# Altium schematic sheet [1]-POWER.SchDoc
size A3; CompanyName: Lumi.,JSC; Organization: Lumi Viet Nam ., JSC; Address1: 4th Floor, LUMI Building; Address2: 38th Do Duc Duc Street; Address3: Nam Tu Liem District; Address4: Ha Noi; DocumentNumber: 1; SheetNumber: 1; SheetTotal: 12
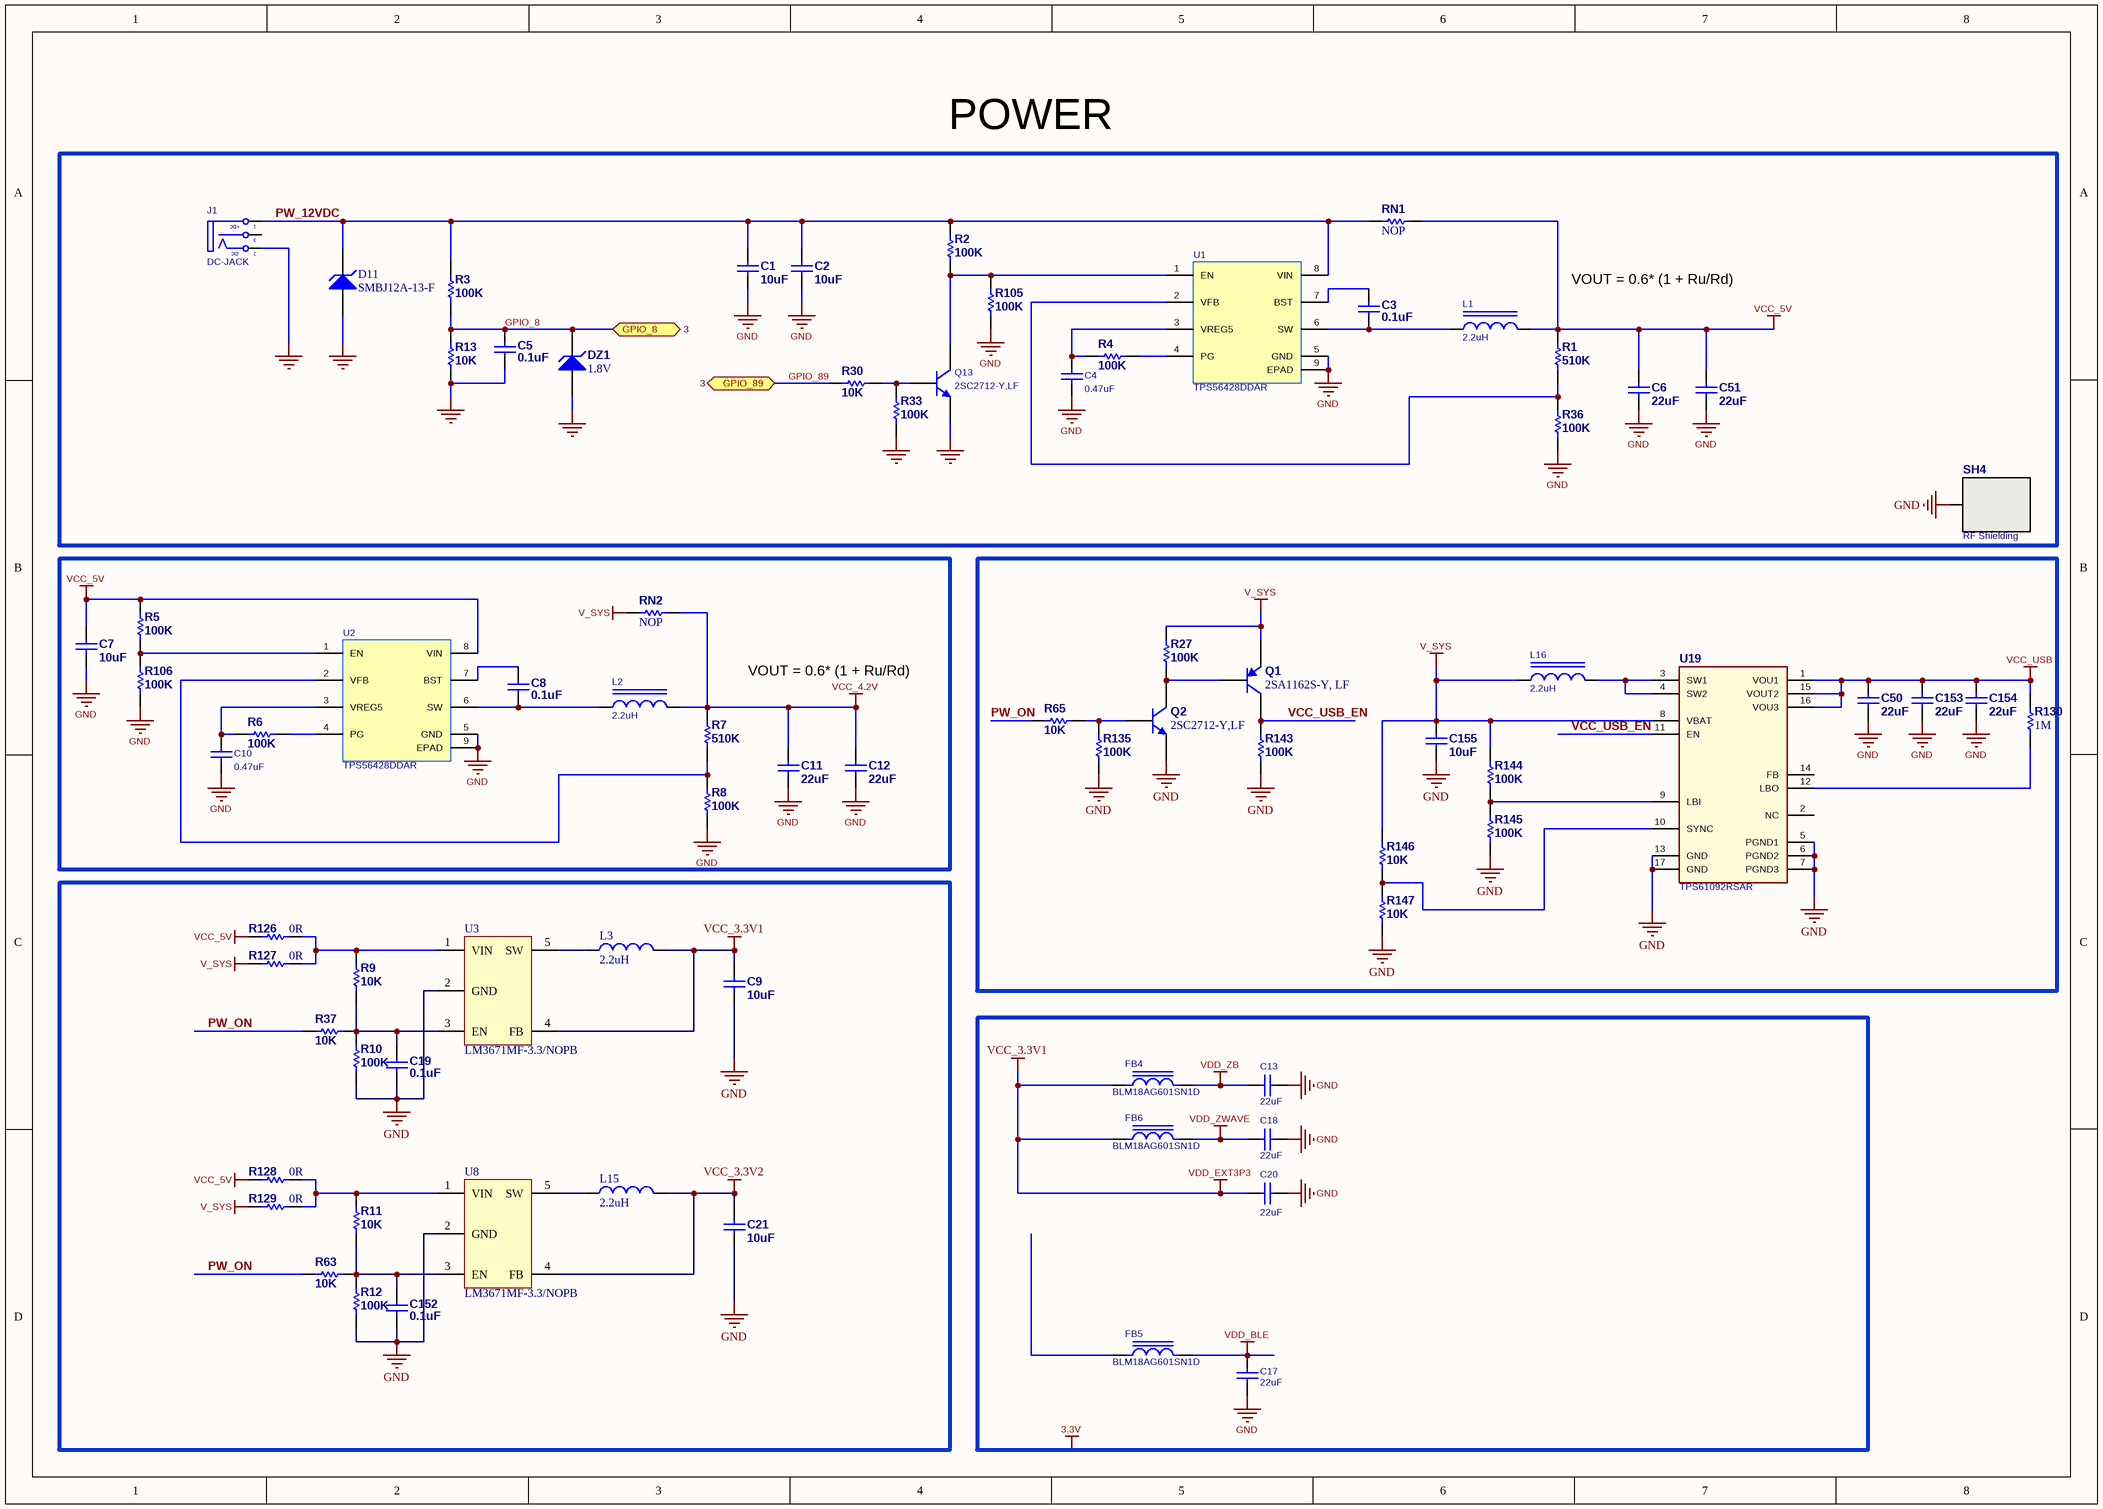
[diagram p0: [1]-POWER.SchDoc]

## Parts
C1  Capacitance: 10uF  [C0805]  (hidden comment: TMK212BBJ106KG-T)
C2  Capacitance: 10uF  [C0805]  (hidden comment: TMK212BBJ106KG-T)
C3  Capacitance: 0.1uF  [C0603]  (hidden comment: 0603B104K500CT)
C4  Capacitance: 0.47uF  [C0603]  (hidden comment: 0603B474K500CT)
C5  Capacitance: 0.1uF  [C0603]  (hidden comment: 0603B104K500CT)
C6  Capacitance: 22uF  [C0805]  (hidden comment: 0805X226M100CT)
C7  Capacitance: 10uF  [C0805]  (hidden comment: TMK212BBJ106KG-T)
C8  Capacitance: 0.1uF  [C0603]  (hidden comment: 0603B104K500CT)
C9  Capacitance: 10uF  [C0805]  (hidden comment: TMK212BBJ106KG-T)
C10  Capacitance: 0.47uF  [C0603]  (hidden comment: 0603B474K500CT)
C11  Capacitance: 22uF  [C0805]  (hidden comment: 0805X226M100CT)
C12  Capacitance: 22uF  [C0805]  (hidden comment: 0805X226M100CT)
C13  Capacitance: 22uF  [C0805]  (hidden comment: 0805X226M100CT)
C17  Capacitance: 22uF  [C0805]  (hidden comment: 0805X226M100CT)
C18  Capacitance: 22uF  [C0805]  (hidden comment: 0805X226M100CT)
C19  Capacitance: 0.1uF  [C0603]  (hidden comment: 0603B104K500CT)
C20  Capacitance: 22uF  [C0805]  (hidden comment: 0805X226M100CT)
C21  Capacitance: 10uF  [C0805]  (hidden comment: TMK212BBJ106KG-T)
C50  Capacitance: 22uF  [C0805]  (hidden comment: 0805X226M100CT)  (no BOM)
C51  Capacitance: 22uF  [C0805]  (hidden comment: 0805X226M100CT)
C152  Capacitance: 0.1uF  [C0603]  (hidden comment: 0603B104K500CT)
C153  Capacitance: 22uF  [C0805]  (hidden comment: 0805X226M100CT)  (no BOM)
C154  Capacitance: 22uF  [C0805]  (hidden comment: 0805X226M100CT)  (no BOM)
C155  Capacitance: 10uF  [C0805]  (hidden comment: TMK212BBJ106KG-T)  (no BOM)
D11  SMBJ12A-13-F  [DO214AC]
DZ1  Max. operating voltage: 1.8V  [SOD323]  (hidden comment: MMSZ5242BT1G)  (no BOM)
FB4  BLM18AG601SN1D  [L0603]
FB5  BLM18AG601SN1D  [L0603]
FB6  BLM18AG601SN1D  [L0603]
J1  DC-JACK  [DC-IN]
L1  Inductance: 2.2uH  [SRP5020TA]  (hidden comment: SRP5020TA-2R2M)
L2  Inductance: 2.2uH  [SRP5020TA]  (hidden comment: SRP5020TA-2R2M)
L3  Inductance: 2.2uH  [L1210]  (hidden comment: BRL3225T2R2M)
L15  Inductance: 2.2uH  [L1210]  (hidden comment: BRL3225T2R2M)
L16  Inductance: 2.2uH  [SRP5020TA]  (hidden comment: SRP5020TA-2R2M)  (no BOM)
Q1  2SA1162S-Y, LF  [SOT23-3]  (no BOM)
Q2  2SC2712-Y,LF  [SOT23-3]  (no BOM)
Q13  2SC2712-Y,LF  [SOT_23_TO_236AB_REFLOW]
R1  Resistance (Ohms): 510K  [R0603]  (hidden comment: RC0603FR-07510KL)
R2  Resistance (Ohms): 100K  [R0603]  (hidden comment: WR06X1003 FTL)
R3  Resistance (Ohms): 100K  [R0603]  (hidden comment: WR06X1003 FTL)
R4  Resistance (Ohms): 100K  [R0603]  (hidden comment: WR06X1003 FTL)
R5  Resistance (Ohms): 100K  [R0603]  (hidden comment: WR06X1003 FTL)
R6  Resistance (Ohms): 100K  [R0603]  (hidden comment: WR06X1003 FTL)
R7  Resistance (Ohms): 510K  [R0603]  (hidden comment: RC0603FR-07510KL)
R8  Resistance (Ohms): 100K  [R0603]  (hidden comment: WR06X1003 FTL)
R9  Resistance (Ohms): 10K  [R0603]  (hidden comment: WR06X103 JTL)
R10  Resistance (Ohms): 100K  [R0603]  (hidden comment: WR06X1003 FTL)
R11  Resistance (Ohms): 10K  [R0603]  (hidden comment: WR06X103 JTL)
R12  Resistance (Ohms): 100K  [R0603]  (hidden comment: WR06X1003 FTL)
R13  Resistance (Ohms): 10K  [R0603]  (hidden comment: WR06X103 JTL)
R27  Resistance (Ohms): 100K  [R0603]  (hidden comment: WR06X1003 FTL)  (no BOM)
R30  Resistance (Ohms): 10K  [R0603]  (hidden comment: WR06X103 JTL)
R33  Resistance (Ohms): 100K  [R0603]  (hidden comment: WR06X1003 FTL)
R36  Resistance (Ohms): 100K  [R0603]  (hidden comment: WR06X1003 FTL)
R37  Resistance (Ohms): 10K  [R0603]  (hidden comment: WR06X103 JTL)  (no BOM)
R63  Resistance (Ohms): 10K  [R0603]  (hidden comment: WR06X103 JTL)  (no BOM)
R65  Resistance (Ohms): 10K  [R0603]  (hidden comment: WR06X103 JTL)  (no BOM)
R105  Resistance (Ohms): 100K  [R0603]  (hidden comment: WR06X1003 FTL)
R106  Resistance (Ohms): 100K  [R0603]  (hidden comment: WR06X1003 FTL)
R126  Resistance (Ohms): 0R  [R0603]  (hidden comment: WR06X000 PTL)
R127  Resistance (Ohms): 0R  [R0603]  (hidden comment: WR06X000 PTL)  (no BOM)
R128  Resistance (Ohms): 0R  [R0603]  (hidden comment: WR06X000 PTL)
R129  Resistance (Ohms): 0R  [R0603]  (hidden comment: WR06X000 PTL)  (no BOM)
R130  Resistance (Ohms): 1M  [R0603]  (hidden comment: WR06X105 FTL)  (no BOM)
R135  Resistance (Ohms): 100K  [R0603]  (hidden comment: WR06X1003 FTL)  (no BOM)
R143  Resistance (Ohms): 100K  [R0603]  (hidden comment: WR06X1003 FTL)  (no BOM)
R144  Resistance (Ohms): 100K  [R0603]  (hidden comment: WR06X1003 FTL)  (no BOM)
R145  Resistance (Ohms): 100K  [R0603]  (hidden comment: WR06X1003 FTL)  (no BOM)
R146  Resistance (Ohms): 10K  [R0603]  (hidden comment: WR06X103 JTL)  (no BOM)
R147  Resistance (Ohms): 10K  [R0603]  (hidden comment: WR06X103 JTL)  (no BOM)
RN1  Resistance (Ohms): NOP  [R1206]  (hidden comment: WR12X000 PTL)  (no BOM)
RN2  Resistance (Ohms): NOP  [R1206]  (hidden comment: WR12X000 PTL)  (no BOM)
SH4  RF Shielding  [RFSHIELD_34x37]  (no BOM)
U1  TPS56428DDAR  [SOP8-PAD]
U2  TPS56428DDAR  [SOP8-PAD]
U3  LM3671MF-3.3/NOPB  [SOT23-5]
U8  LM3671MF-3.3/NOPB  [SOT23-5]
U19  TPS61092RSAR  [QFN16-4x4x0.7-0.65]  (no BOM)

## Blocks framed on the sheet
POWER: C1-C6 C51 D11 DZ1 J1 L1 Q13 R1-R4 R13 R30 R33 R36 R105 RN1 SH4 U1
VOUT = 0.6* (1 + Ru/Rd): C7 C8 C10-C12 L2 R5-R8 R106 RN2 U2

## Ports
GPIO_8 (bidir, see 3), GPIO_89 (bidir, see 3)

## Nets
GND: C1.1 C2.1 C4.1 C5.1 C6.1 C7.1 C9.1 C10.1 C11.1 C12.1 C13.1 C17.2 C18.2 C19.1 C20.1 C21.1 C50.1 C51.1 C152.1 C153.1 C154.1 C155.1 D11.1(A) DZ1.1(A) J1.2(TN) Q2.2(E) Q13.2(E) R8.2 R10.2 R12.2 R13.1 R33.1 R36.2 R105.1 R106.1 R135.2 R143.2 R145.2 R147.2 SH4.1 U1.5(GND) U1.9(EPAD) U2.5(GND) U2.9(EPAD) U3.2(GND) U8.2(GND) U19.5(PGND1) U19.6(PGND2) U19.7(PGND3) U19.13(GND) U19.17(GND)
V_SYS: C155.2 L16.1 Q1.2(E) R27.1 R127.1 R129.1 R144.1 R146.1 RN2.1 U19.8(VBAT)
VCC_3.3V1: C9.2 C20.2 FB4.1 FB6.1 L3.2 U3.4(FB)  [also labelled VDD_EXT3P3]
VCC_3.3V2: C21.2 L15.2 U8.4(FB)
VCC_4.2V: C11.2 C12.2 L2.2 R7.1 RN2.2
VCC_5V: C6.2 C7.2 C51.2 L1.2 R1.1 R5.2 R126.1 R128.1 RN1.2 U2.8(VIN)
VCC_USB: C50.2 C153.2 C154.2 R130.2 U19.1(VOU1) U19.15(VOUT2) U19.16(VOU3)
VDD_BLE: C17.1 FB5.2
VDD_ZB: C13.2 FB4.2
VDD_ZWAVE: C18.1 FB6.2
GPIO_8: C5.2 DZ1.2(K) R3.1 R13.2 ; port GPIO_8
GPIO_89: R30.2 ; port GPIO_89
PW_12VDC: C1.2 C2.2 D11.2(K) J1.1(T) R2.2 R3.2 RN1.1 U1.8(VIN)
PW_ON: R37.2 R63.2 R65.1
VCC_USB_EN: Q1.3(C) R143.1 U19.11(EN)
NetC3_1: C3.1 L1.1 U1.6(SW)
NetC3_2: C3.2 U1.7(BST)
NetC4_2: C4.2 R4.2 U1.3(VREG5)
NetC8_1: C8.1 L2.1 U2.6(SW)
NetC8_2: C8.2 U2.7(BST)
NetC10_2: C10.2 R6.2 U2.3(VREG5)
NetC19_2: C19.2 R9.2 R10.1 R37.1 U3.3(EN)
NetC152_2: C152.2 R11.2 R12.1 R63.1 U8.3(EN)
NetL3_1: L3.1 U3.5(SW)
NetL15_1: L15.1 U8.5(SW)
NetL16_2: L16.2 U19.3(SW1) U19.4(SW2)
NetQ1_1: Q1.1(B) Q2.3(C) R27.2
NetQ2_1: Q2.1(B) R65.2 R135.1
NetQ13_1: Q13.1(B) R30.1 R33.2
NetQ13_3: Q13.3(C) R2.1 R105.2 U1.1(EN)
NetR1_2: R1.2 R36.1 U1.2(VFB)
NetR4_1: R4.1 U1.4(PG)
NetR5_1: R5.1 R106.2 U2.1(EN)
NetR6_1: R6.1 U2.4(PG)
NetR7_2: R7.2 R8.1 U2.2(VFB)
NetR9_1: R9.1 R126.2 R127.2 U3.1(VIN)
NetR11_1: R11.1 R128.2 R129.2 U8.1(VIN)
NetR130_1: R130.1 U19.12(LBO)
NetR144_2: R144.2 R145.1 U19.9(LBI)
NetR146_2: R146.2 R147.1 U19.10(SYNC)

Not connected (* = marked no-connect by the designer): FB5 1; J1 3(S); SH4 2; U19 2(NC) 14(FB)

## Notes on the sheet
- VOUT = 0.6* (1 + Ru/Rd)
- Labels drawn without touching a wire or pin: 3.3V
- (in symbol DCIN) +DC; -DC

## Library data of the parts
C1 C2 C7 C9 C21 C155 = CAP_10uF_0805: CAP, CERM, 10uF, 25V, +/-10%, X5R, 0402; Manufacturer Device Package: 0805; Manufacturer: Taiyo Yuden; Lumi PART: CAP_10uF_0805; Manufacturer Part Number: TMK212BBJ106KG-T; Size / Dimension: 2.0mm x 1.25mm x 1.25mm; Alias: CAP_10uF_0805; Operating voltage: 25V; Price: 0.035
C3 C5 C8 C19 C152 = CERM_0.1uF_0603: CAP, CERM, 0.1uF, 50V, +/-10%, X7R, 0603; Manufacturer Device Package: 0603 (1608 Metric); Lumi PART: CAP_104_0603; Manufacturer: Walsin; Alias: CAP_0.1uF_0603; Manufacturer Part Number: 0603B104K500CT; Size / Dimension: 1.60mm x 0.80mm x 0.8mm; Operating voltage: 50V
C4 C10 = CERM_0.47uF_0603: CAP, CERM, 0.47uF, 50V, +/-10%, X7R, 0603; Manufacturer Device Package: 0603 (1608 Metric); Lumi PART: CAP_0.47uF_0603; Manufacturer: Walsin; Manufacturer Part Number: 0603B474K500CT; Size / Dimension: 1.60mm x 0.80mm x 0.8mm; Alias: CAP_0.47uF_0603; Operating voltage: 50V
C6 C11 C12 C50 C51 C153 C154 = CERM_22uF_0805: CAP, CERM, 22uF, 10V, +/-20%, X5R, 0805; Manufacturer Device Package: 0805 (2012 Metric); Lumi PART: CAP_22uF_0805; Manufacturer: Walsin; Manufacturer Part Number: 0805X226M100CT; Size / Dimension: 2.0mm x 1.25mm x 1.25mm; Alias: CAP_22uF_0805; Operating voltage: 10V
C13 C17 C18 C20 = CERM_22uF_0805: CAP, CERM, 22uF, 10V, +/-20%, X5R, 0805; Manufacturer Device Package: 0805 (2012 Metric); Lumi PART: CAP_22uF_0805; Manufacturer: Walsin; Tolerance: ±20%; Component Type: Ceramic X5R; Mounting: SMD; Supplier: LUMI; Manufacturer Part Number: 0805X226M100CT; Category: Capacitors; Part Status: Active; Size / Dimension: 2.0mm x 1.25mm; Height: 1.25mm; Alias: CAP_22uF_0805; Operating voltage: 10V; Package / Case: 0805
D11 = SMBJ12A-13-F: ESD Suppressors / TVS Diodes 600W 12.0V; Manufacturer: Diodes Incorporated; LUMI PART: DIODE_SMBJ12A-13-F; Manufacturer Device Package: SMB; Max. operating voltage: 12V; Component Type: TVS; Height: 2.5mm; Category: Diode; Part Status: Active; Supplier: LUMI; Mounting: SMD; Package / Case: SMB; Alias: DIODE_SMBJ12A-13-F; Power (W): 600W; Manufacturer Part Number: SMBJ12A-13-F
DZ1 = DIODE_MMSZ5242BT1G: DIODE, Zener, SOD-123, 500mW, 12V; Manufacturer: Fairchild Semiconductor; Power (W): 0.5W; Size / Dimension: 3.80mm x 1.80mm x 1.7mm; LUMI PART: DIODE_MMSZ5242BT1G; Manufacturer Device Package: SOD-123; Alias: DIODE_MMSZ5242BT1G; Manufacturer Part Number: MMSZ5242BT1G
FB4-FB6 = FB_BLM18AG601SN1D: EMI Filter Beads, 600 Ohms, 500mA, 0603; Manufacturer: Murata; Manufacturer Device Package: 0603 (1608 metric); Tolerance: ±25%; Component Type: Ferrit Bead; Height: 0.8mm; Size / Dimension: 1.6mm x 0.8mm; Category: Inductor; Part Status: Active; LUMI PART: FB_BLM18AG601SN1D; Supplier: LUMI; Mounting: SMD; Alias: FB_BLM18AG601SN1D; Package / Case: 0603; DC Current: 500mA; Impedance: 600 Ohms; Manufacturer Part Number: BLM18AG601SN1D
J1 = DCIN: Jac DC input; Value: Jac DC
L1 L2 L16 = SRP5020TA-2R2M: IND,5.7X5.2X1.8MM,2.2UH20%,4.2A; Manufacturer: Bourns; Size / Dimension: 5.7X5.2X1.8MM; Manufacturer Part Number: SRP5020TA-2R2M; LUMI PART: SRP5020TA-2R2M; Manufacturer Device Package: 5.7X5.2X1.8MM; Alias: SRP5020TA-2R2M; DC Current: 4.2A
L3 L15 = BRL3225T2R2M: Fixed Inductors 10uH; Manufacturer: Taiyo Yuden; LUMI PART: IND_2.2uH_3225; DC Resistance: 65 mOhms; Tolerance: ±20%; DC Current: 1.8A; Component Type: Inductor Fixed; Height: 1.7 mm; Size / Dimension: 3.2x2.5x1.7 mm; Manufacturer Part Number: BRL3225T2R2M; Category: Inductor; Part Status: Active; Supplier: LUMI; Mounting: SMD; Alias: IND_2.2uH_3225
Q1 = TRANS_2SA1162-Y: TRANS, PNP, 50V, 0.15A, SOT-23-3; Manufacturer: Toshiba; Lumi PART: TRANS_BC807; Manufacturer Device Package: TO-236-3, SC-59, SOT-23-3; Current - Collector (Ic) (Max): 150mA; Voltage - Collector Emitter Breakdown (Max): 50V; Alias: TRANS_2SA1162-Y; Size / Dimension: 2.9mm x 2.5mm; Manufacturer Part Number: 2SA1162S-Y, LF
Q2 Q13 = TRANS_SC2712-Y: TRANS, NPN, 50V, 0.15A, SOT-23-3; Manufacturer: Toshiba; Lumi PART: TRANS_MMBT3904; Manufacturer Device Package: TO-236-3, SC-59, SOT-23-3; Current - Collector (Ic) (Max): 150mA; Voltage - Collector Emitter Breakdown (Max): 50V; Alias: TRANS_SC2712-Y; Size / Dimension: 2.9mm x 2.5mm; Manufacturer Part Number: 2SC2712-Y,LF
R1 R7 = RES_510K_0603: Thick Film Resistors 510K OHM 1%; Manufacturer: Yageo; Max. operating voltage: 50V; Manufacturer Part Number: RC0603FR-07510KL; LUMI PART: RES_510K_0603; Alias: RES_510K_0603; Package / Case: 0603
R2-R6 R8 R10 R12 R27 R33 R36 R105 R106 R135 R143-R145 = RES_100K_0603: RES, SMD, ThickFilm, 100K, 1/10W, 1%, 0603; Manufacturer: Walsin; Manufacturer Device Package: 0603 (1608 Metric); Power (Watts): 0.1W, 1/10W; Size / Dimension: 1.60mm x 0.80mm x 0.45mm; Manufacturer Part Number: WR06X1003 FTL; LUMI PART: RES_100K_0603; Alias: RES_100K_0603
R9 R11 R13 R30 R37 R63 R65 R146 R147 = RES_10K_0603: RES, SMD, ThickFilm, 10K, 1/10W, 5%, 0603; Manufacturer: Walsin; Manufacturer Device Package: 0603 (1608 Metric); Power (Watts): 0.1W, 1/10W; Size / Dimension: 1.60mm x 0.80mm x 0.45mm; Manufacturer Part Number: WR06X103 JTL; LUMI PART: RES_10K_0603; Alias: RES_10K_0603
R126-R129 = RES_0R_0603: RES, SMD, ThickFilm, 0R, JUMPER, 0603; Manufacturer: Walsin; Manufacturer Device Package: 0603 (1608 Metric); Power (Watts): 0.1W, 1/10W; Manufacturer Part Number: WR06X000 PTL; LUMI PART: RES_0R_0603; Size / Dimension: 1.60mm x 0.80mm x 0.45mm; Alias: RES_0R_0603
R130 = RES_1M_0603: RES, SMD, ThickFilm, 1M, 1/10W, 1%, 0603; Manufacturer: Walsin; Manufacturer Device Package: 0603 (1608 Metric); Power (Watts): 0.1W, 1/10W; Size / Dimension: 1.60mm x 0.80mm x 0.45mm; Manufacturer Part Number: WR06X105 FTL; LUMI PART: RES_1M_0603; Alias: RES_1M_0603
RN1 RN2 = RES_0R_1206: RES, SMD, ThickFilm, 0R, JUMPER, 1206; Manufacturer: Walsin; Manufacturer Device Package: 1206 (3216 Metric); Power (Watts): 0.25W, 1/4W; Manufacturer Part Number: WR12X000 PTL; LUMI PART: RES_0R_1206; Size / Dimension: 3.10mm x 1.60mm x 0.6mm; Alias: RES_0R_1206
SH4 = RF_SHIELDING
U1 U2 = TPS56428DDAR: IC REG BUCK ADJUSTABLE 4A 8SOPWR; Manufacturer 1: Texas Instruments; Number of Outputs: 1; Output Voltage: 7V; Min Input Voltage: 4.5V; Max Input Voltage: 18V; Switching Frequency: 650kHz; Min Output Voltage: 600mV; Synchronous Rectifier: Yes; Quiescent Current: 250uA; Output Configuration: Positive; ComponentLink1URL: https://datasheet.ciiva.com/30031/tps56428-30031600.pdf?src-supplier=Avnet; ComponentLink1Description: https://datasheet.ciiva.com/30031/tps56428-30031600.pdf?src-supplier=Avnet; ComponentLink2URL: https://datasheet.ciiva.com/14941/tps56428-14941146.pdf?src-supplier=Digi-Key; ComponentLink2Description: https://datasheet.ciiva.com/14941/tps56428-14941146.pdf?src-supplier=Digi-Key; ComponentLink3URL: https://datasheet.ciiva.com/14941/tps56428-14941147.pdf?src-supplier=Digi-Key; ComponentLink3Description: https://datasheet.ciiva.com/14941/tps56428-14941147.pdf?src-supplier=Digi-Key; Supplier 1: Digi-Key; Manufacturer Part Number 1: TPS56428DDAR; Stock 1: 1198; Pricing 1: 1=1.84000, 10=1.65700, 25=1.56320, 100=1.25040, 250=1.09412, 500=1.06286, 1000=0.84403 (USD); RoHS: Yes; Mount: Surface Mount; Number of Pins: 8; Min Operating Temperature: -40°C; Max Operating Temperature: 85°C; Max Output Current: 4A; Package Quantity: 2500; Packaging: Tape and Reel; Output Current: 4A; Max Output Voltage: 7V; Operating Supply Voltage: 18V; Output Type: Adjustable; Radiation Hardening: No; Lead Free: Lead Free; Supplier Part Number 1: 296-35856-1-ND
U3 U8 = LM3671MF-3.3/NOPB: Switching Voltage Regulators 2MHZ,600MA STEP-DOWN DC-DC CONVERTER; Manufacturer: Texas Instruments; Manufacturer Device Package: SOT-23-5; Max. operating voltage: 5.5V; Component Type: Power IC; Height: 1mm; Size / Dimension: 3.0mm x 3.0mm; Category: IC; Part Status: Active; Supplier: LUMI; Mounting: SMD; Package / Case: SOT-23-5; Manufacturer Part Number: LM3671MF-3.3/NOPB; Current: 600mA; Alias: LM3671MF-3.3/NOPB; LUMI PART: LM3671MF-3.3/NOPB
U19 = TPS61092RSAR: IC REG BOOST 5V 2A 16QFN; Manufacturer Device Package: QFN-16; Manufacturer: TI; LUMI PART: TPS61092RSAR; Price: 0.25767; Alias: TPS61092RSAR; Size / Dimension: 3x3mm; Manufacturer Part Number: TPS61092RSAR